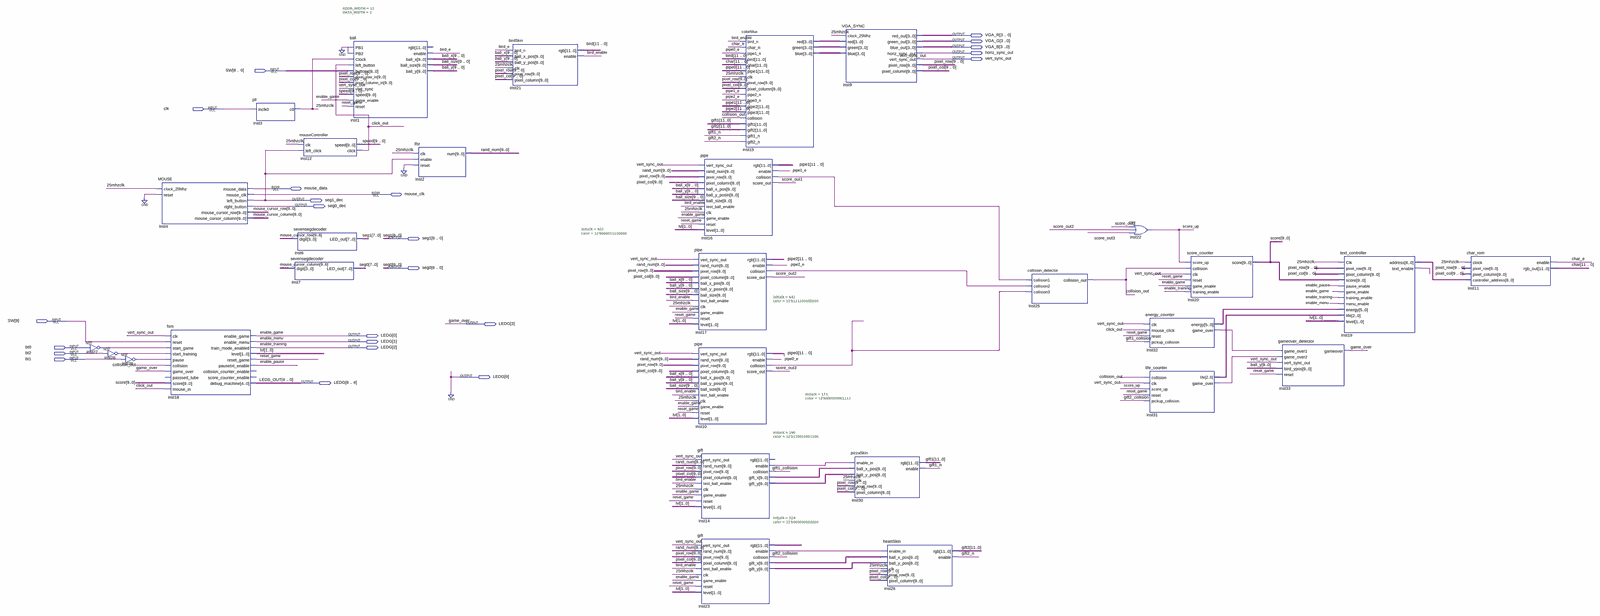
[diagram p0: schematic sheet, whole]
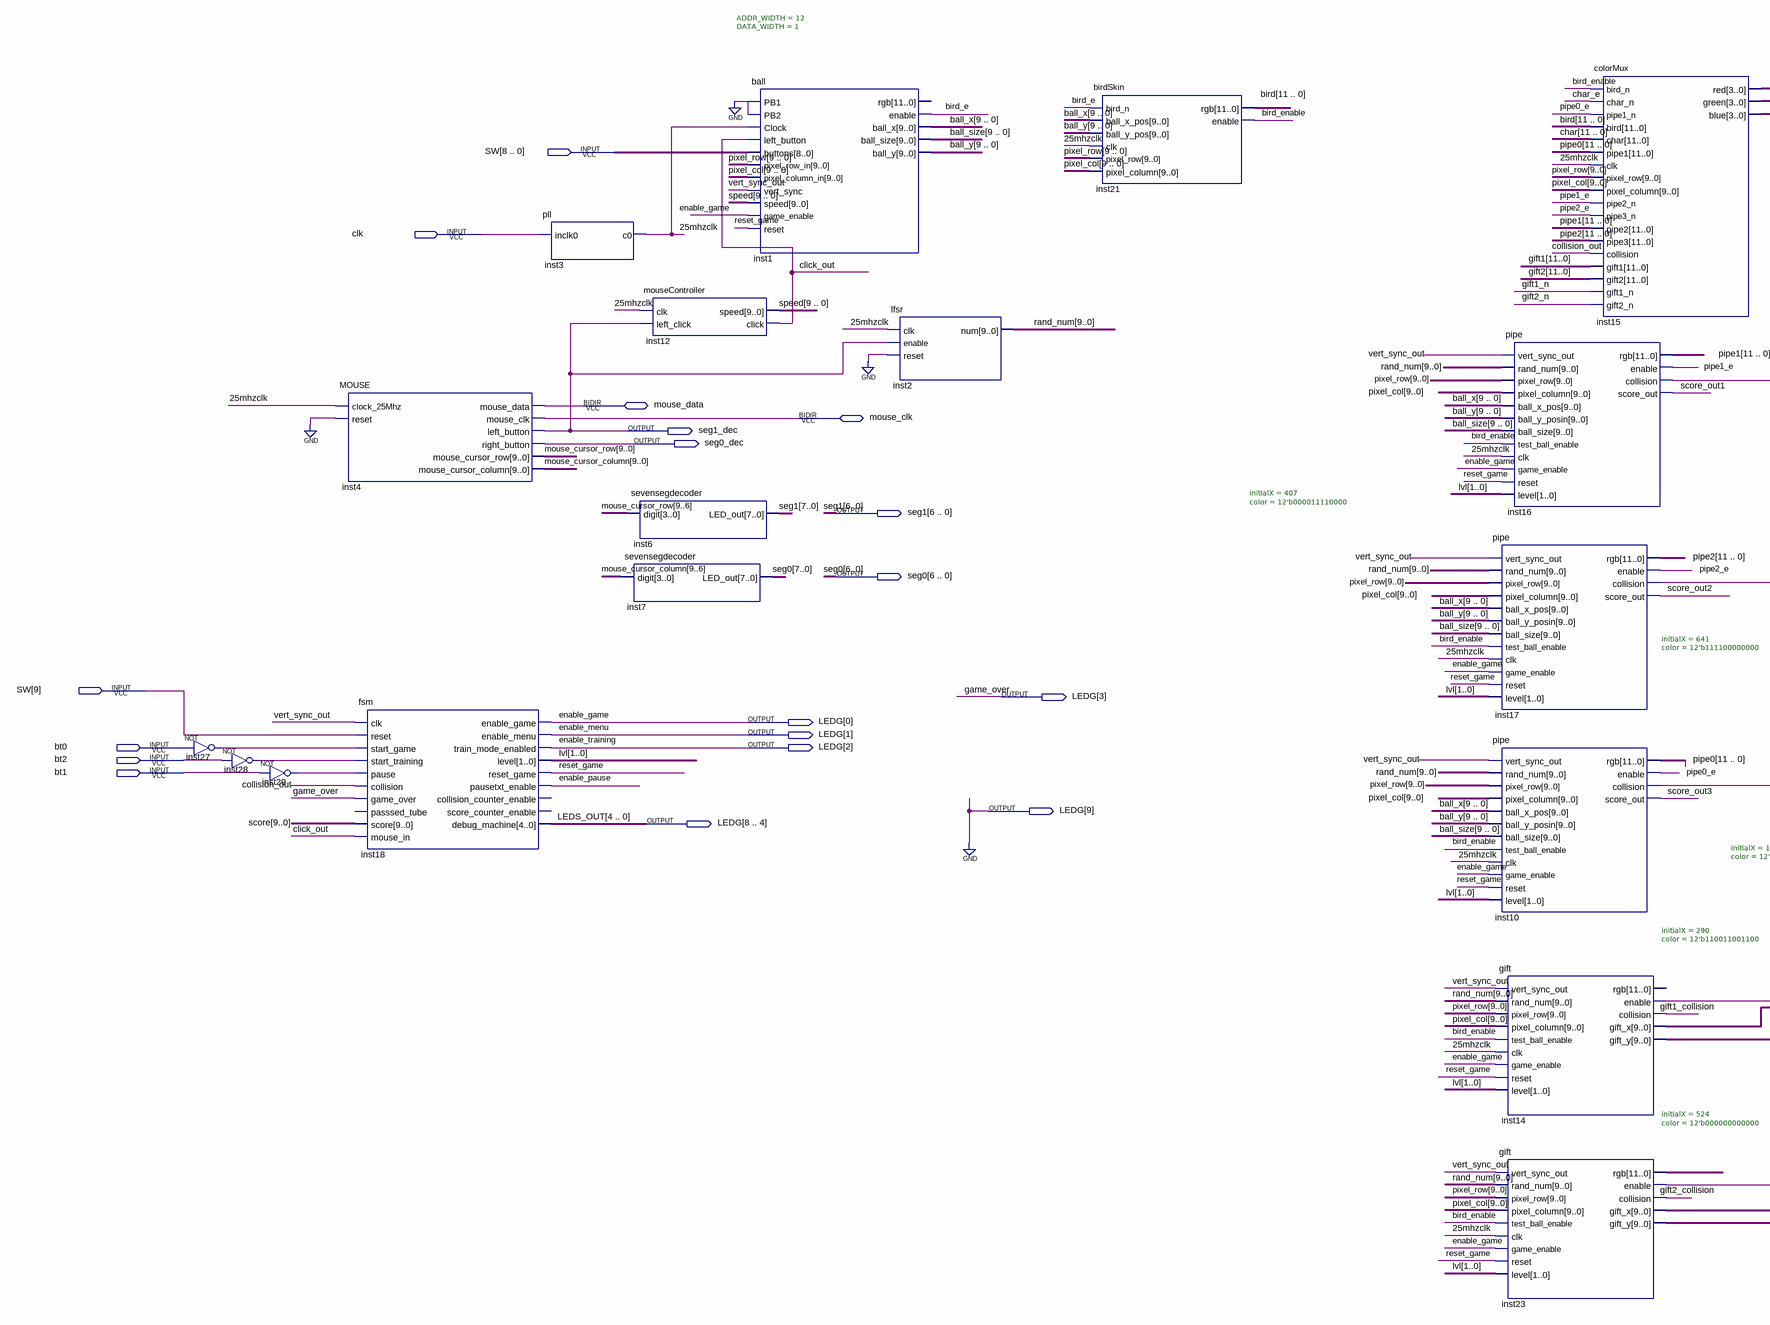
[diagram p1: schematic sheet, left part]
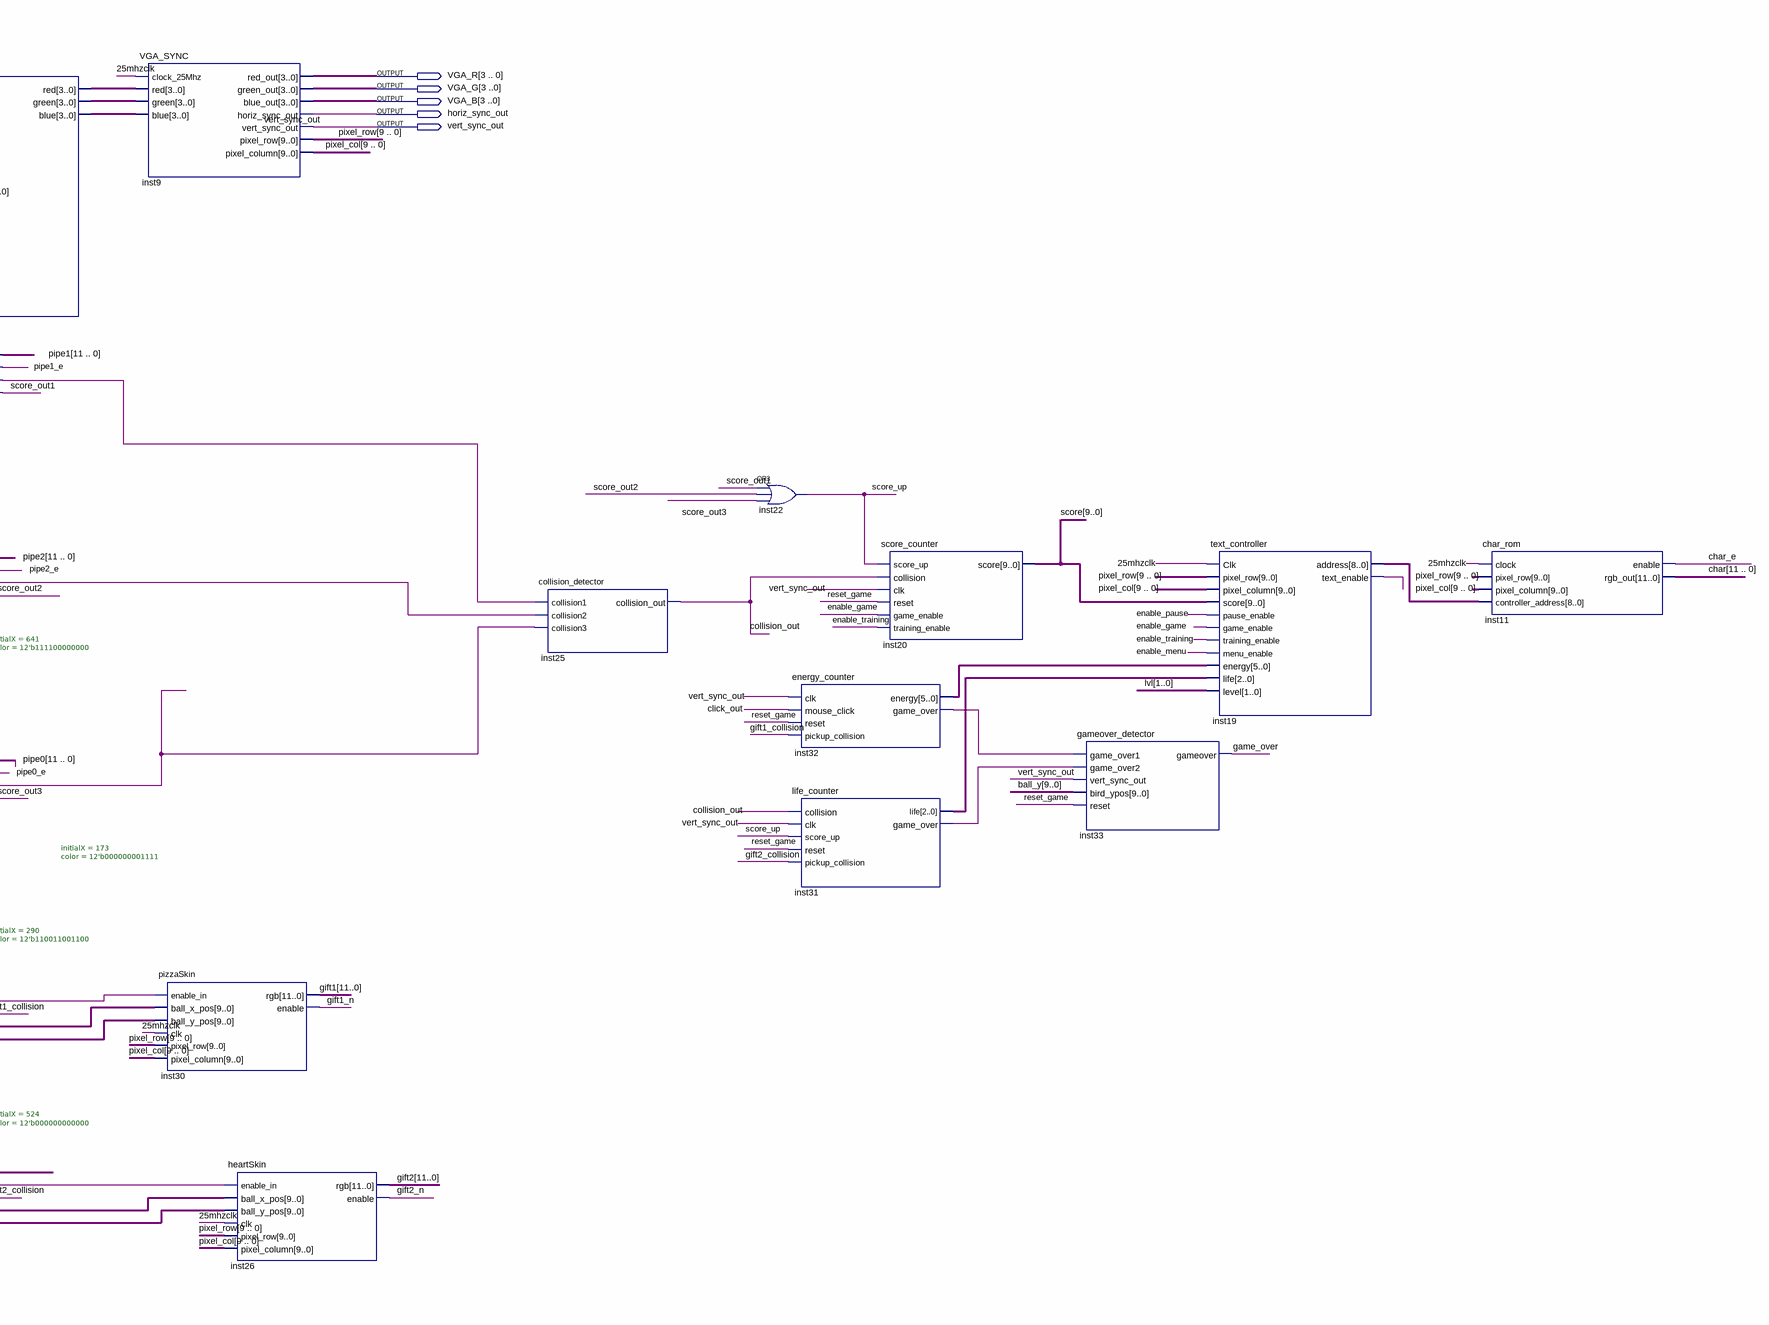
[diagram p2: schematic sheet, right part]
// Quartus schematic BouncingBall.bdf as structural Verilog: 29 symbols, 23 pins
module BouncingBall (
  input  [9:0] SW,
  input  clk,
  input  bt0,
  input  bt2,
  input  bt1,
  inout  mouse_data,
  inout  mouse_clk,
  output [3:0] VGA_R,
  output [3:0] VGA_G,
  output [3:0] VGA_B,
  output horiz_sync_out,
  output vert_sync_out,
  output seg1_dec,
  output seg0_dec,
  output [7:0] seg1,
  output [7:0] seg0,
  output [9:0] LEDG
);

  wire \25mhzclk , bird_e, bird_enable, char_e, click_out, collision_out, enable_pause, gift1_collision,
       gift1_n, gift2_collision, gift2_n, inst10_collision, inst14_enable, inst16_collision,
       inst17_collision, inst19_text_enable, inst23_enable, inst27_out, inst28_out, inst29_out,
       inst31_game_over, inst32_game_over, pipe0_e, pipe1_e, pipe2_e, reset_game, score_out1, score_out2,
       score_out3, score_up;
  wire [1:0] lvl;
  wire [2:0] inst31_life;
  wire [3:0] inst15_blue, inst15_green, inst15_red;
  wire [5:0] inst32_energy;
  wire [8:0] inst19_address;
  wire [9:0] ball_size, ball_x, ball_y, inst14_gift_x, inst14_gift_y, inst23_gift_x, inst23_gift_y,
       mouse_cursor_column, mouse_cursor_row, pixel_col, pixel_row, rand_num, score, speed;
  wire [11:0] bird, char, gift1, gift2, inst23_rgb, pipe0, pipe1, pipe2;

  not inst27 (inst27_out, bt0);
  not inst28 (inst28_out, bt2);
  not inst29 (inst29_out, bt1);
  MOUSE inst4 (
    .clock_25Mhz(\25mhzclk ), .reset(1'b0), .left_button(seg1_dec), .right_button(seg0_dec),
    .mouse_cursor_row(mouse_cursor_row), .mouse_cursor_column(mouse_cursor_column), .mouse_data(mouse_data),
    .mouse_clk(mouse_clk));
  fsm inst18 (
    .clk(vert_sync_out), .reset(SW[9]), .start_game(inst27_out), .start_training(inst28_out),
    .pause(inst29_out), .collision(collision_out), .game_over(LEDG[3]), .score(score), .mouse_in(click_out),
    .enable_game(LEDG[0]), .enable_menu(LEDG[1]), .train_mode_enabled(LEDG[2]), .level(lvl),
    .reset_game(reset_game), .pausetxt_enable(enable_pause), .debug_machine(LEDG[8:4]));  // open: passsed_tube, collision_counter_enable, score_counter_enable
  pll inst3 (.inclk0(clk), .c0(\25mhzclk ));
  mouseController inst12 (.clk(\25mhzclk ), .left_click(seg1_dec), .speed(speed), .click(click_out));
  sevensegdecoder inst6 (.digit(mouse_cursor_row[9:6]), .LED_out(seg1));
  sevensegdecoder inst7 (.digit(mouse_cursor_column[9:6]), .LED_out(seg0));
  ball #(.ADDR_WIDTH(12), .DATA_WIDTH(1)) inst1 (
    .PB1(1'b0), .PB2(1'b0), .Clock(\25mhzclk ), .left_button(click_out), .buttons(SW[8:0]),
    .pixel_row_in(pixel_row), .pixel_column_in(pixel_col), .vert_sync(vert_sync_out), .speed(speed),
    .game_enable(LEDG[0]), .reset(reset_game), .enable(bird_e), .ball_x(ball_x), .ball_size(ball_size),
    .ball_y(ball_y));  // open: rgb
  lfsr inst2 (.clk(\25mhzclk ), .enable(seg1_dec), .reset(1'b0), .num(rand_num));
  birdSkin inst21 (
    .bird_n(bird_e), .ball_x_pos(ball_x), .ball_y_pos(ball_y), .clk(\25mhzclk ), .pixel_row(pixel_row),
    .pixel_column(pixel_col), .rgb(bird), .enable(bird_enable));
  pipe #(.initialX(407), .color(12'b000011110000)) inst16 (
    .vert_sync_out(vert_sync_out), .rand_num(rand_num), .pixel_row(pixel_row), .pixel_column(pixel_col),
    .ball_x_pos(ball_x), .ball_y_posin(ball_y), .ball_size(ball_size), .test_ball_enable(bird_enable),
    .clk(\25mhzclk ), .game_enable(LEDG[0]), .reset(reset_game), .level(lvl), .rgb(pipe1), .enable(pipe1_e),
    .collision(inst16_collision), .score_out(score_out1));
  pipe #(.initialX(641), .color(12'b111100000000)) inst17 (
    .vert_sync_out(vert_sync_out), .rand_num(rand_num), .pixel_row(pixel_row), .pixel_column(pixel_col),
    .ball_x_pos(ball_x), .ball_y_posin(ball_y), .ball_size(ball_size), .test_ball_enable(bird_enable),
    .clk(\25mhzclk ), .game_enable(LEDG[0]), .reset(reset_game), .level(lvl), .rgb(pipe2), .enable(pipe2_e),
    .collision(inst17_collision), .score_out(score_out2));
  pipe #(.initialX(173), .color(12'b000000001111)) inst10 (
    .vert_sync_out(vert_sync_out), .rand_num(rand_num), .pixel_row(pixel_row), .pixel_column(pixel_col),
    .ball_x_pos(ball_x), .ball_y_posin(ball_y), .ball_size(ball_size), .test_ball_enable(bird_enable),
    .clk(\25mhzclk ), .game_enable(LEDG[0]), .reset(reset_game), .level(lvl), .rgb(pipe0), .enable(pipe0_e),
    .collision(inst10_collision), .score_out(score_out3));
  gift #(.initialX(290), .color(12'b110011001100)) inst14 (
    .vert_sync_out(vert_sync_out), .rand_num(rand_num), .pixel_row(pixel_row), .pixel_column(pixel_col),
    .test_ball_enable(bird_enable), .clk(\25mhzclk ), .game_enable(LEDG[0]), .reset(reset_game), .level(lvl),
    .enable(inst14_enable), .collision(gift1_collision), .gift_x(inst14_gift_x), .gift_y(inst14_gift_y));  // open: rgb
  gift #(.initialX(524), .color(12'b000000000000)) inst23 (
    .vert_sync_out(vert_sync_out), .rand_num(rand_num), .pixel_row(pixel_row), .pixel_column(pixel_col),
    .test_ball_enable(bird_enable), .clk(\25mhzclk ), .game_enable(LEDG[0]), .reset(reset_game), .level(lvl),
    .rgb(inst23_rgb), .enable(inst23_enable), .collision(gift2_collision), .gift_x(inst23_gift_x),
    .gift_y(inst23_gift_y));
  colorMux inst15 (
    .bird_n(bird_enable), .char_n(char_e), .pipe1_n(pipe0_e), .bird(bird), .char(char), .pipe1(pipe0),
    .clk(\25mhzclk ), .pixel_row(pixel_row), .pixel_column(pixel_col), .pipe2_n(pipe1_e), .pipe3_n(pipe2_e),
    .pipe2(pipe1), .pipe3(pipe2), .collision(collision_out), .gift1(gift1), .gift2(gift2), .gift1_n(gift1_n),
    .gift2_n(gift2_n), .red(inst15_red), .green(inst15_green), .blue(inst15_blue));
  VGA_SYNC inst9 (
    .clock_25Mhz(\25mhzclk ), .red(inst15_red), .green(inst15_green), .blue(inst15_blue), .red_out(VGA_R),
    .green_out(VGA_G), .blue_out(VGA_B), .horiz_sync_out(horiz_sync_out), .vert_sync_out(vert_sync_out),
    .pixel_row(pixel_row), .pixel_column(pixel_col));
  pizzaSkin inst30 (
    .enable_in(inst14_enable), .ball_x_pos(inst14_gift_x), .ball_y_pos(inst14_gift_y), .clk(\25mhzclk ),
    .pixel_row(pixel_row), .pixel_column(pixel_col), .rgb(gift1), .enable(gift1_n));
  heartSkin inst26 (
    .enable_in(inst23_enable), .ball_x_pos(inst23_gift_x), .ball_y_pos(inst23_gift_y), .clk(\25mhzclk ),
    .pixel_row(pixel_row), .pixel_column(pixel_col), .rgb(gift2), .enable(gift2_n));
  collision_detector inst25 (
    .collision1(inst16_collision), .collision2(inst17_collision), .collision3(inst10_collision),
    .collision_out(collision_out));
  or inst22 (score_up, score_out1, score_out2, score_out3);
  energy_counter inst32 (
    .clk(vert_sync_out), .mouse_click(click_out), .reset(reset_game), .pickup_collision(gift1_collision),
    .energy(inst32_energy), .game_over(inst32_game_over));
  life_counter inst31 (
    .collision(collision_out), .clk(vert_sync_out), .score_up(score_up), .reset(reset_game),
    .pickup_collision(gift2_collision), .life(inst31_life), .game_over(inst31_game_over));
  score_counter inst20 (
    .score_up(score_up), .collision(collision_out), .clk(vert_sync_out), .reset(reset_game),
    .game_enable(LEDG[0]), .training_enable(LEDG[2]), .score(score));
  gameover_detector inst33 (
    .game_over1(inst32_game_over), .game_over2(inst31_game_over), .vert_sync_out(vert_sync_out),
    .bird_ypos(ball_y), .reset(reset_game), .gameover(LEDG[3]));
  text_controller inst19 (
    .Clk(\25mhzclk ), .pixel_row(pixel_row), .pixel_column(pixel_col), .score(score),
    .pause_enable(enable_pause), .game_enable(LEDG[0]), .training_enable(LEDG[2]), .menu_enable(LEDG[1]),
    .energy(inst32_energy), .life(inst31_life), .level(lvl), .address(inst19_address),
    .text_enable(inst19_text_enable));
  char_rom inst11 (
    .clock(\25mhzclk ), .pixel_row(pixel_row), .pixel_column(pixel_col), .controller_address(inst19_address),
    .enable(char_e), .rgb_out(char));

  assign LEDG[9] = 1'b0;

  // Other names for the same wires on the sheet: enable_game = LEDG[0]; enable_menu = LEDG[1];
  //   enable_training = LEDG[2]; game_over = LEDG[3]; LEDS_OUT[4:0] = LEDG[8:4]
endmodule
